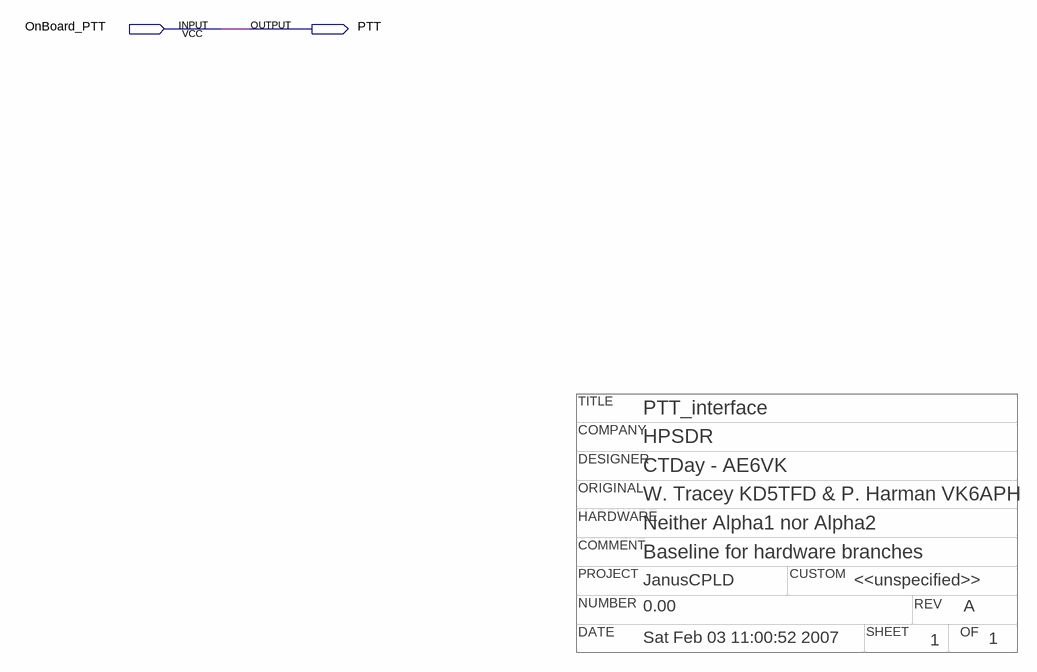
[diagram p0: schematic sheet]
// Quartus schematic PTT_interface.bdf as structural Verilog: 0 symbols, 2 pins
// Title block: TITLE: PTT_interface; COMPANY: HPSDR; DESIGNER: CTDay - AE6VK; NUMBER: 0.00; REV: A; DATE: Sat Feb 03 11:00:52 2007; SHEET: 1; OF: 1; ORIGINAL: W. Tracey KD5TFD & P. Harman VK6APH; HARDWARE: Neither Alpha1 nor Alpha2; COMMENT: Baseline for hardware branches; PROJECT: JanusCPLD; CUSTOM: <<unspecified>>
module PTT_interface (
  input  OnBoard_PTT,
  output PTT
);


  assign PTT = OnBoard_PTT;
endmodule
